# Altium project OBC_V1.PrjPcb
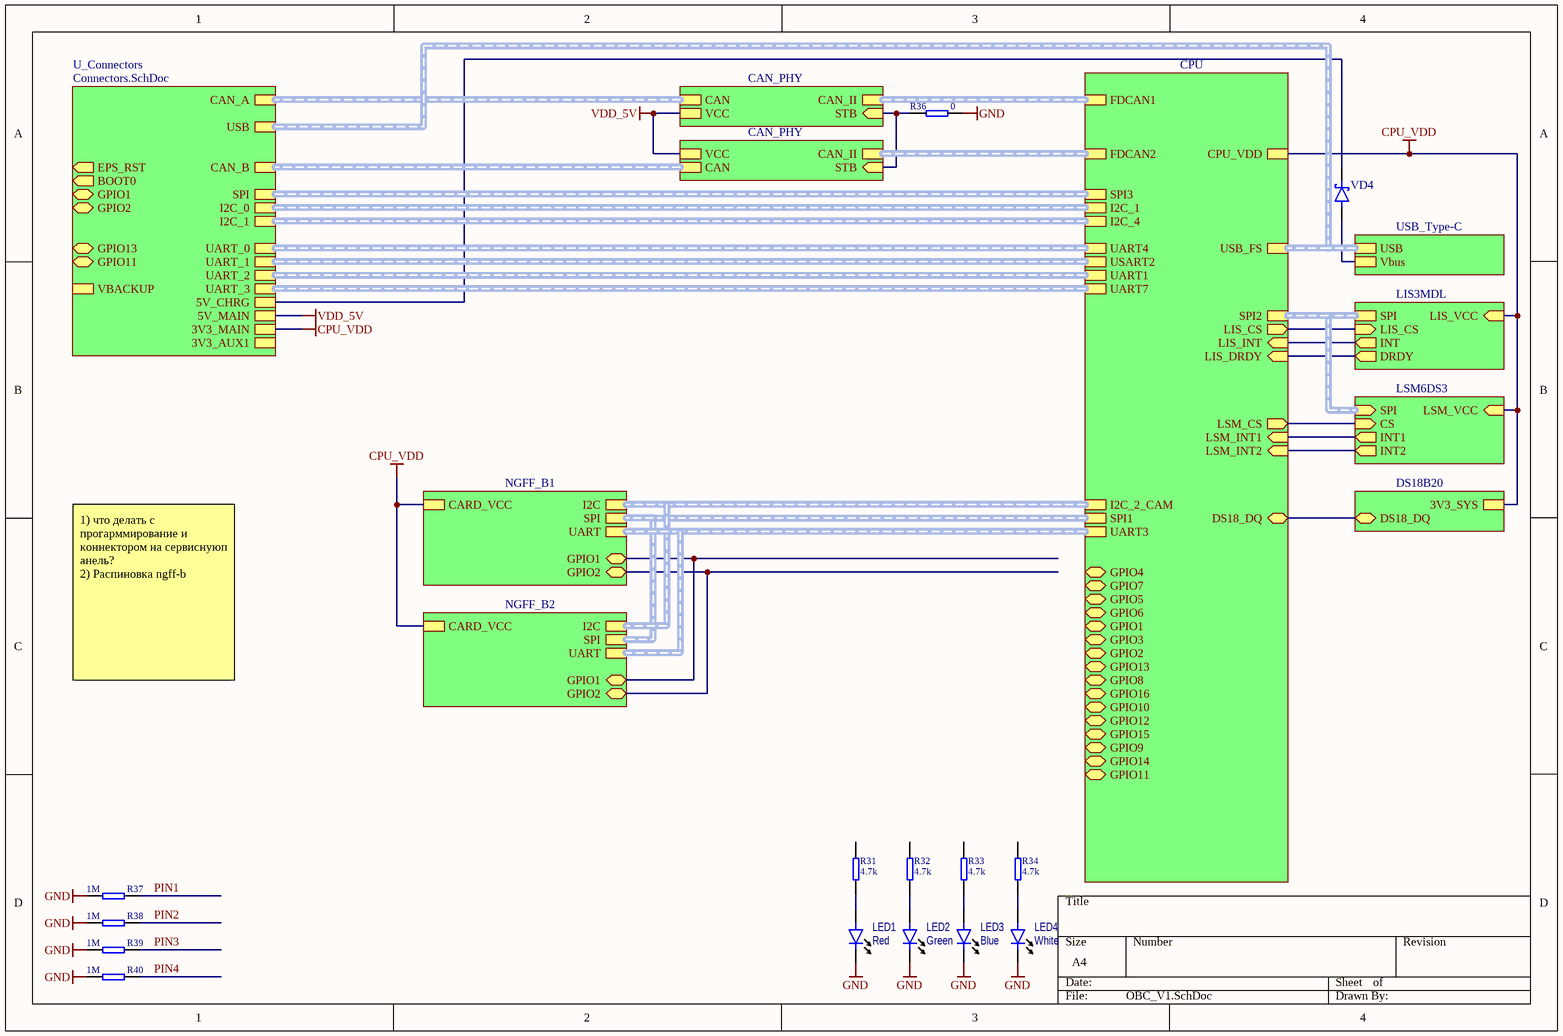
[diagram p0: OBC_V1.SchDoc]
11 sheets, 90 parts. Net scope: hierarchical (ports join the sheet entries above them; power ports are global).
Board files: OBC_V1.PcbDoc, NGFF_B_Board.PcbDoc
Sheets:
  OBC_V1.SchDoc
    U_Connectors = Connectors.SchDoc
    CPU = CPU.SchDoc
    LIS3MDL = LIS3MDL.SchDoc
    LSM6DS3 = LSM6DS3.SchDoc
    CAN_PHY = CAN_PHY.SchDoc
    CAN_PHY = CAN_PHY.SchDoc
    USB_Type-C = USB_Type-C.SchDoc
    DS18B20 = DS18B20.SchDoc
    NGFF_B1 = NGFF_B.SchDoc
    NGFF_B2 = NGFF_B.SchDoc
  Debugger.SchDoc
  Photodiode.SchDoc

## Sheet OBC_V1.SchDoc
size A4; SheetNumber: 1; SheetTotal: 11

### Parts
LED1  value Red  [LED 0805]
LED2  value Green  [LED 0805]
LED3  value Blue  [LED 0805]
LED4  value White  [LED 0805]
R31  value 4.7k  [RES 0603]
R32  value 4.7k  [RES 0603]
R33  value 4.7k  [RES 0603]
R34  value 4.7k  [RES 0603]
R36  value 0  [RES 0603]
R37  value 1M  [RES 0402]
R38  value 1M  [RES 0402]
R39  value 1M  [RES 0402]
R40  value 1M  [RES 0402]
VD4  (no value)  [SOD-123]

### Sub-sheets
CAN_PHY = CAN_PHY.SchDoc: VCC, STB (in), CAN (harness CAN), CAN_II (harness CAN_II)
CAN_PHY = CAN_PHY.SchDoc: VCC, STB (in), CAN (harness CAN), CAN_II (harness CAN_II)
CPU = CPU.SchDoc: SPI3 (harness SPI), I2C_2_CAM (harness I2C), I2C_1 (harness I2C), USB_FS (harness USB), SPI1 (harness SPI), I2C_4 (harness I2C), SPI2 (harness SPI), FDCAN1 (harness CAN_II), FDCAN2 (harness CAN_II), UART4 (harness UART), UART7 (harness UART), UART1 (harness UART), USART2 (harness UART), CPU_VDD, LIS_CS (out), LIS_INT (in), LIS_DRDY (in), LSM_CS (out), LSM_INT1 (in), LSM_INT2 (in), DS18_DQ (bidir), UART3 (harness UART), GPIO4 (bidir), GPIO7 (bidir), GPIO5 (bidir), GPIO6 (bidir), GPIO1 (bidir), GPIO3 (bidir), GPIO2 (bidir), GPIO13 (bidir), GPIO8 (bidir), GPIO16 (bidir), GPIO10 (bidir), GPIO12 (bidir), GPIO15 (bidir), GPIO9 (bidir), GPIO14 (bidir), GPIO11 (bidir)
DS18B20 = DS18B20.SchDoc: DS18_DQ (bidir), 3V3_SYS
LIS3MDL = LIS3MDL.SchDoc: LIS_VCC (in), SPI (harness SPI), DRDY (out), INT (out), LIS_CS (in)
LSM6DS3 = LSM6DS3.SchDoc: CS (in), LSM_VCC (in), SPI (in, harness SPI), INT1 (out), INT2 (out)
NGFF_B1 = NGFF_B.SchDoc: UART (harness UART), CARD_VCC, I2C (harness I2C), SPI (harness SPI), GPIO1 (bidir), GPIO2 (bidir)
NGFF_B2 = NGFF_B.SchDoc: UART (harness UART), CARD_VCC, I2C (harness I2C), SPI (harness SPI), GPIO1 (bidir), GPIO2 (bidir)
U_Connectors = Connectors.SchDoc: 3V3_MAIN, VBACKUP, CAN_A (harness CAN), CAN_B (harness CAN), I2C_0 (harness I2C), I2C_1 (harness I2C), 5V_CHRG, 3V3_AUX1, UART_1 (harness UART), UART_0 (harness UART), UART_2 (harness UART), UART_3 (harness UART), USB (harness USB), EPS_RST (out), BOOT0 (out), GPIO1 (bidir), GPIO2 (bidir), 5V_MAIN, SPI (harness SPI), GPIO13 (bidir), GPIO11 (bidir)
USB_Type-C = USB_Type-C.SchDoc: USB (harness USB), Vbus

### Nets
CPU_VDD: sheet U_Connectors/3V3_MAIN, sheet CPU/CPU_VDD, sheet LIS3MDL/LIS_VCC, sheet LSM6DS3/LSM_VCC, sheet DS18B20/3V3_SYS, sheet NGFF_B1/CARD_VCC, sheet NGFF_B2/CARD_VCC  [project net 3V3_MAIN]
GND: LED1.2(Cathode) LED2.2(Cathode) LED3.2(Cathode) LED4.2(Cathode) R36.2 R37.1 R38.1 R39.1 R40.1
VDD_5V: sheet U_Connectors/5V_MAIN, sheet CAN_PHY/VCC, sheet CAN_PHY/VCC  [project net 5V_MAIN]
5V_CHRG: VD4.C(Cathode) ; sheet U_Connectors/5V_CHRG
DS18_DQ: sheet CPU/DS18_DQ, sheet DS18B20/DS18_DQ
LIS_CS: sheet CPU/LIS_CS, sheet LIS3MDL/LIS_CS
LIS_DRDY: sheet CPU/LIS_DRDY, sheet LIS3MDL/DRDY
LIS_INT1: sheet CPU/LIS_INT, sheet LIS3MDL/INT
LSM_CS: sheet CPU/LSM_CS, sheet LSM6DS3/CS
LSM_INT1: sheet CPU/LSM_INT1, sheet LSM6DS3/INT1
LSM_INT2: sheet CPU/LSM_INT2, sheet LSM6DS3/INT2
PIN1: R37.2
PIN2: R38.2
PIN3: R39.2
PIN4: R40.2
NetLED1_1: LED1.1(Anode) R31.1
NetLED2_1: LED2.1(Anode) R32.1
NetLED3_1: LED3.1(Anode) R33.1
NetLED4_1: LED4.1(Anode) R34.1
NetR36_1: R36.1 ; sheet CAN_PHY/STB, sheet CAN_PHY/STB
NetUSB1_A4B9: VD4.A(Anode) ; sheet USB_Type-C/Vbus
NetX4_NGFF_B1_26: sheet NGFF_B1/GPIO2, sheet NGFF_B2/GPIO2
NetX4_NGFF_B1_28: sheet NGFF_B1/GPIO1, sheet NGFF_B2/GPIO1

Not connected (* = marked no-connect by the designer): R31 2(12); R32 2(12); R33 2(12); R34 2(12)

### Buses and harness runs
harness sheet CAN_PHY/CAN = sheet U_Connectors/CAN_A
harness sheet CAN_PHY/CAN = sheet U_Connectors/CAN_B
harness sheet CAN_PHY/CAN_II = sheet CPU/FDCAN1
harness sheet CAN_PHY/CAN_II = sheet CPU/FDCAN2
harness sheet CPU/I2C_1 = sheet U_Connectors/I2C_0
harness sheet CPU/I2C_2_CAM = sheet NGFF_B1/I2C = sheet NGFF_B2/I2C
harness sheet CPU/I2C_4 = sheet U_Connectors/I2C_1
harness sheet CPU/SPI1 = sheet NGFF_B1/SPI = sheet NGFF_B2/SPI
harness sheet CPU/SPI2 = sheet LIS3MDL/SPI = sheet LSM6DS3/SPI
harness sheet CPU/SPI3 = sheet U_Connectors/SPI
harness sheet CPU/UART1 = sheet U_Connectors/UART_2
harness sheet CPU/UART3 = sheet NGFF_B1/UART = sheet NGFF_B2/UART
harness sheet CPU/UART4 = sheet U_Connectors/UART_0
harness sheet CPU/UART7 = sheet U_Connectors/UART_3
harness sheet CPU/USART2 = sheet U_Connectors/UART_1
harness sheet CPU/USB_FS = sheet U_Connectors/USB = sheet USB_Type-C/USB

### Notes on the sheet
- 1) что делать с прогарммирование и коннектором на сервиснуюп анель?
  2) Распиновка ngff-b

### Library data of the parts
LED1-LED4 = LED: Light Emittering Diode; IsSMT: NoSMT
R31-R34 R36-R40 = !Resistor: Resistor; IsSMT: NoSMT
VD4 = DiodeS: Diode Shottky; IsSMT: NoSMT

## Sheet Connectors.SchDoc
size A4; SheetNumber: 2; SheetTotal: 11
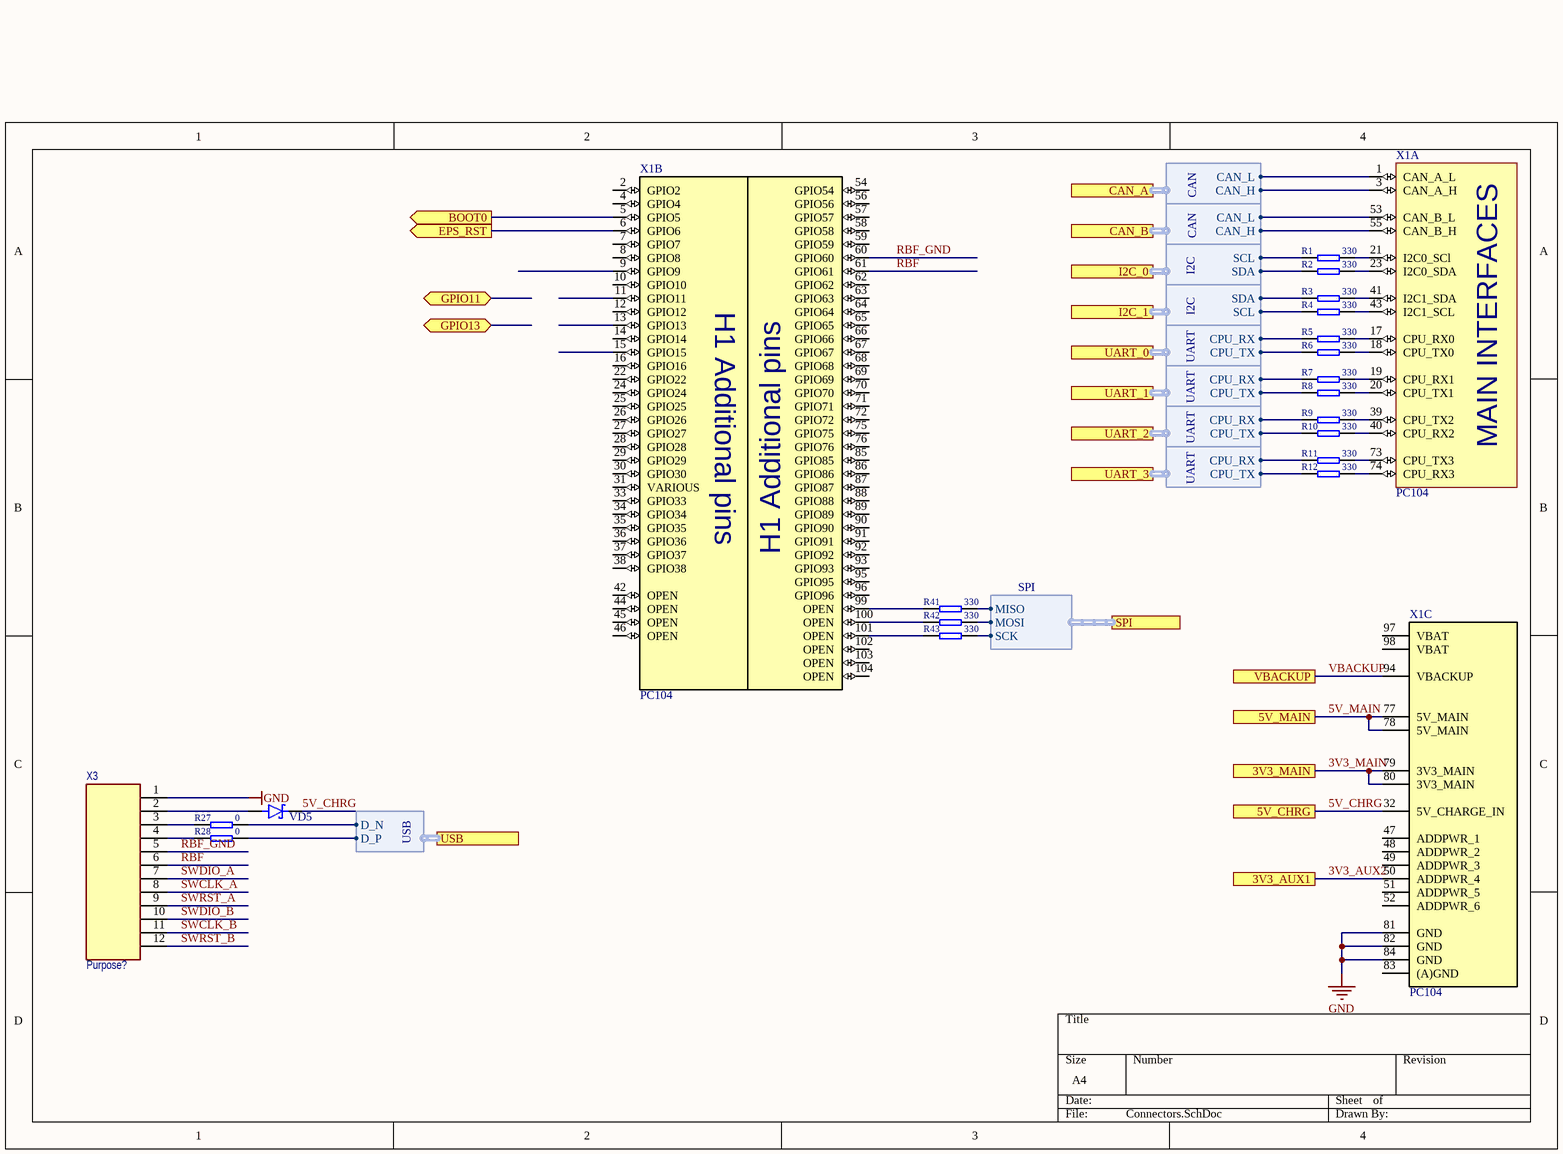
[diagram p1: Connectors.SchDoc]

### Parts
R1  value 330  [RES 0603]
R2  value 330  [RES 0603]
R3  value 330  [RES 0603]
R4  value 330  [RES 0603]
R5  value 330  [RES 0603]
R6  value 330  [RES 0603]
R7  value 330  [RES 0603]
R8  value 330  [RES 0603]
R9  value 330  [RES 0603]
R10  value 330  [RES 0603]
R11  value 330  [RES 0603]
R12  value 330  [RES 0603]
R27  value 0  [RES 0603]
R28  value 0  [RES 0603]
R41  value 330  [RES 0603]
R42  value 330  [RES 0603]
R43  value 330  [RES 0603]
VD5  (no value)  [SOD-123]
X1  PC104  [PC104_ArianSpace]  (parts A,B,C of 3)
X3  Purpose: Purpose?  [PicoBlade_12P]  (hidden comment: Header?)

### Ports
3V3_AUX1, 3V3_MAIN, 5V_CHRG, 5V_MAIN, BOOT0 (out), CAN_A (harness CAN), CAN_B (harness CAN), EPS_RST (out), GPIO11 (bidir), GPIO13 (bidir), I2C_0 (harness I2C), I2C_1 (harness I2C), SPI (harness SPI), UART_0 (harness UART), UART_1 (harness UART), UART_2 (harness UART), UART_3 (harness UART), USB (harness USB), VBACKUP

### Harnesses
CAN: CAN_H, CAN_L
I2C: SDA, SCL
UART: CPU_TX, CPU_RX
USB: D_N, D_P
SPI: SCK, MISO, MOSI

### Nets
3V3_MAIN: X1.79(3V3_MAIN) X1.80(3V3_MAIN) ; port 3V3_MAIN
5V_MAIN: X1.77(5V_MAIN) X1.78(5V_MAIN) ; port 5V_MAIN
GND: X1.81(GND) X1.82(GND) X1.84(GND) X3.1
3V3_AUX2: X1.50(ADDPWR_4) ; port 3V3_AUX1
5V_CHRG: VD5.C(Cathode) X1.32(5V_CHARGE_IN) ; port 5V_CHRG
CAN_H: X1.3(CAN_A_H) ; port CAN_A.CAN_H
CAN_H: X1.55(CAN_B_H) ; port CAN_B.CAN_H  [a separate net that carries the same name]
CAN_L: X1.1(CAN_A_L) ; port CAN_A.CAN_L
CAN_L: X1.53(CAN_B_L) ; port CAN_B.CAN_L  [a separate net that carries the same name]
CPU_RX1: R9.1 ; port UART_2.CPU_RX
CPU_RX2: R7.1 ; port UART_1.CPU_RX
CPU_RX4: R5.1 ; port UART_0.CPU_RX
CPU_RX7: R11.1 ; port UART_3.CPU_RX
CPU_TX1: R10.1 ; port UART_2.CPU_TX
CPU_TX2: R8.1 ; port UART_1.CPU_TX
CPU_TX4: R6.1 ; port UART_0.CPU_TX
CPU_TX7: R12.1 ; port UART_3.CPU_TX
I2C1_SCL: R1.1 ; port I2C_0.SCL
I2C1_SDA: R2.1 ; port I2C_0.SDA
I2C4_SCL: R4.1 ; port I2C_1.SCL
I2C4_SDA: R3.1 ; port I2C_1.SDA
RBF: X1.61(GPIO61) X3.6
RBF_GND: X1.60(GPIO60) X3.5
SPI3_MISO: R41.2 ; port SPI.MISO
SPI3_MOSI: R42.2 ; port SPI.MOSI
SPI3_SCK: R43.2 ; port SPI.SCK
SWCLK_A: X3.8
SWCLK_B: X3.11
SWDIO_A: X3.7
SWDIO_B: X3.10
SWRST_A: X3.9
SWRST_B: X3.12
USB_D_N: R27.2 ; port USB.D_N
USB_D_P: R28.2 ; port USB.D_P
VBACKUP: X1.94(VBACKUP) ; port VBACKUP
NetR1_2: R1.2 X1.21(I2C0_SCl)
NetR2_2: R2.2 X1.23(I2C0_SDA)
NetR3_2: R3.2 X1.41(I2C1_SDA)
NetR4_2: R4.2 X1.43(I2C1_SCL)
NetR5_2: R5.2 X1.17(CPU_RX0)
NetR6_2: R6.2 X1.18(CPU_TX0)
NetR7_2: R7.2 X1.19(CPU_RX1)
NetR8_2: R8.2 X1.20(CPU_TX1)
NetR9_2: R9.2 X1.39(CPU_TX2)
NetR10_2: R10.2 X1.40(CPU_RX2)
NetR11_2: R11.2 X1.73(CPU_TX3)
NetR12_2: R12.2 X1.74(CPU_RX3)
NetR27_1: R27.1 X3.3
NetR28_1: R28.1 X3.4
NetR41_1: R41.1 X1.99(OPEN)
NetR42_1: R42.1 X1.100(OPEN)
NetR43_1: R43.1 X1.101(OPEN)
NetVD5_A: VD5.A(Anode) X3.2
NetX1_5: X1.5(GPIO5) ; port BOOT0
NetX1_6: X1.6(GPIO6) ; port EPS_RST

Not connected (* = marked no-connect by the designer): X1 2(GPIO2) 4(GPIO4) 7(GPIO7) 8(GPIO8) 9(GPIO9) 10(GPIO10) 11(GPIO11) 12(GPIO12) 13(GPIO13) 14(GPIO14) 15(GPIO15) 16(GPIO16) 22(GPIO22) 24(GPIO24) 25(GPIO25) 26(GPIO26) 27(GPIO27) 28(GPIO28) 29(GPIO29) 30(GPIO30) 31(VARIOUS) 33(GPIO33) 34(GPIO34) 35(GPIO35) 36(GPIO36) 37(GPIO37) 38(GPIO38) 42(OPEN) 44(OPEN) 45(OPEN) 46(OPEN) 47(ADDPWR_1) 48(ADDPWR_2) 49(ADDPWR_3) 51(ADDPWR_5) 52(ADDPWR_6) 54(GPIO54) 56(GPIO56) 57(GPIO57) 58(GPIO58) 59(GPIO59) 62(GPIO62) 63(GPIO63) 64(GPIO64) 65(GPIO65) 66(GPIO66) 67(GPIO67) 68(GPIO68) 69(GPIO69) 70(GPIO70) 71(GPIO71) 72(GPIO72) 75(GPIO75) 76(GPIO76) 83((A)GND) 85(GPIO85) 86(GPIO86) 87(GPIO87) 88(GPIO88) 89(GPIO89) 90(GPIO90) 91(GPIO91) 92(GPIO92) 93(GPIO93) 95(GPIO95) 96(GPIO96) 97(VBAT) 98(VBAT) 102(OPEN) 103(OPEN) 104(OPEN)

### Notes on the sheet
- (in symbol PC104_ArianSpace, part A) MAIN INTERFACES
- (in symbol PC104_ArianSpace, part B) H1 Additional pins

### Library data of the parts
R1-R12 R27 R28 R41-R43 = !Resistor: Resistor; IsSMT: NoSMT
VD5 = DiodeS: Diode Shottky; IsSMT: NoSMT
X1 = PC104_ArianSpace: PC104 connector
X3 = Header 1x12: 10x1 Header; IsSMT: NoSMT

## Sheet CPU.SchDoc
size A4; SheetNumber: 3; SheetTotal: 11
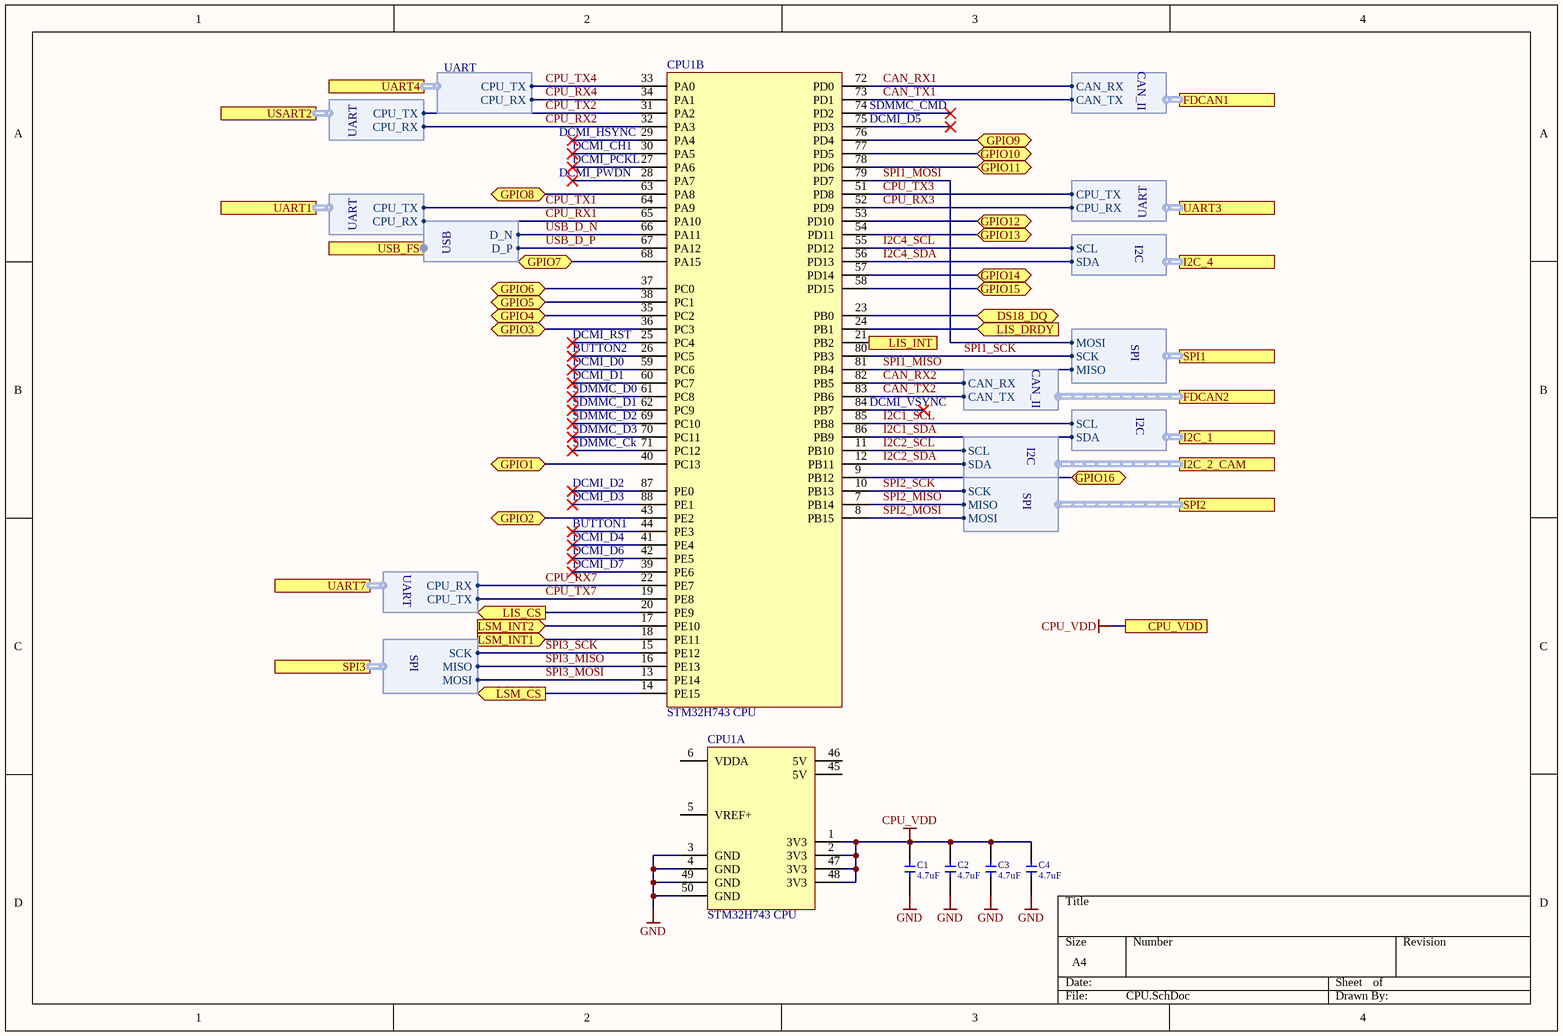
[diagram p2: CPU.SchDoc]

### Parts
C1  value 4.7uF  [CERCAP 0603]
C2  value 4.7uF  [CERCAP 0603]
C3  value 4.7uF  [CERCAP 0603]
C4  value 4.7uF  [CERCAP 0603]
CPU1  STM32H743 CPU  [STM32H7_CPU]  (parts A,B of 2)

### Ports
CPU_VDD, DS18_DQ (bidir), FDCAN1 (harness CAN_II), FDCAN2 (harness CAN_II), GPIO1 (bidir), GPIO2 (bidir), GPIO3 (bidir), GPIO4 (bidir), GPIO5 (bidir), GPIO6 (bidir), GPIO7 (bidir), GPIO8 (bidir), GPIO9 (bidir), GPIO10 (bidir), GPIO11 (bidir), GPIO12 (bidir), GPIO13 (bidir), GPIO14 (bidir), GPIO15 (bidir), GPIO16 (bidir), I2C_1 (harness I2C), I2C_2_CAM (harness I2C), I2C_4 (harness I2C), LIS_CS (out), LIS_DRDY (in), LIS_INT (in), LSM_CS (out), LSM_INT1 (in), LSM_INT2 (in), SPI1 (harness SPI), SPI2 (harness SPI), SPI3 (harness SPI), UART1 (harness UART), UART3 (harness UART), UART4 (harness UART), UART7 (harness UART), USART2 (harness UART), USB_FS (harness USB)

### Harnesses
I2C: SDA, SCL
CAN_II: CAN_RX, CAN_TX
SPI: MOSI, SCK, MISO
USB: D_N, D_P
UART: CPU_RX, CPU_TX

### Nets
CPU_VDD: C1.2 C2.2 C3.2 C4.2 CPU1.1(3V3) CPU1.2(3V3) CPU1.47(3V3) CPU1.48(3V3) ; port CPU_VDD  [project net 3V3_MAIN]
GND: C1.1 C2.1 C3.1 C4.1 CPU1.3(GND) CPU1.4(GND) CPU1.49(GND) CPU1.50(GND)
CAN_RX1: CPU1.72(PD0) ; port FDCAN1.CAN_RX
CAN_RX2: CPU1.82(PB5) ; port FDCAN2.CAN_RX
CAN_TX1: CPU1.73(PD1) ; port FDCAN1.CAN_TX
CAN_TX2: CPU1.83(PB6) ; port FDCAN2.CAN_TX
CPU_RX1: CPU1.65(PA10) ; port UART1.CPU_RX
CPU_RX2: CPU1.32(PA3) ; port USART2.CPU_RX
CPU_RX3: CPU1.52(PD9) ; port UART3.CPU_RX
CPU_RX4: CPU1.34(PA1) ; port UART4.CPU_RX
CPU_RX7: CPU1.22(PE7) ; port UART7.CPU_RX
CPU_TX1: CPU1.64(PA9) ; port UART1.CPU_TX
CPU_TX2: CPU1.31(PA2) ; port USART2.CPU_TX
CPU_TX3: CPU1.51(PD8) ; port UART3.CPU_TX
CPU_TX4: CPU1.33(PA0) ; port UART4.CPU_TX
CPU_TX7: CPU1.19(PE8) ; port UART7.CPU_TX
DS18_DQ: CPU1.23(PB0) ; port DS18_DQ
I2C1_SCL: CPU1.85(PB8) ; port I2C_1.SCL
I2C1_SDA: CPU1.86(PB9) ; port I2C_1.SDA
I2C2_SCL: CPU1.11(PB10) ; port I2C_2_CAM.SCL
I2C2_SDA: CPU1.12(PB11) ; port I2C_2_CAM.SDA
I2C4_SCL: CPU1.55(PD12) ; port I2C_4.SCL
I2C4_SDA: CPU1.56(PD13) ; port I2C_4.SDA
LIS_CS: CPU1.20(PE9) ; port LIS_CS
LIS_DRDY: CPU1.24(PB1) ; port LIS_DRDY
LIS_INT1: CPU1.21(PB2) ; port LIS_INT
LSM_CS: CPU1.14(PE15) ; port LSM_CS
LSM_INT1: CPU1.18(PE11) ; port LSM_INT1
LSM_INT2: CPU1.17(PE10) ; port LSM_INT2
SPI1_MISO: CPU1.81(PB4) ; port SPI1.MISO
SPI1_MOSI: CPU1.79(PD7) ; port SPI1.MOSI
SPI1_SCK: CPU1.80(PB3) ; port SPI1.SCK
SPI2_MISO: CPU1.7(PB14) ; port SPI2.MISO
SPI2_MOSI: CPU1.8(PB15) ; port SPI2.MOSI
SPI2_SCK: CPU1.10(PB13) ; port SPI2.SCK
SPI3_MISO: CPU1.16(PE13) ; port SPI3.MISO
SPI3_MOSI: CPU1.13(PE14) ; port SPI3.MOSI
SPI3_SCK: CPU1.15(PE12) ; port SPI3.SCK
USB_D_N: CPU1.66(PA11) ; port USB_FS.D_N
USB_D_P: CPU1.67(PA12) ; port USB_FS.D_P
NetCPU1_9: CPU1.9(PB12) ; port GPIO16
NetCPU1_35: CPU1.35(PC2) ; port GPIO4
NetCPU1_36: CPU1.36(PC3) ; port GPIO3
NetCPU1_37: CPU1.37(PC0) ; port GPIO6
NetCPU1_38: CPU1.38(PC1) ; port GPIO5
NetCPU1_40: CPU1.40(PC13) ; port GPIO1
NetCPU1_43: CPU1.43(PE2) ; port GPIO2
NetCPU1_53: CPU1.53(PD10) ; port GPIO12
NetCPU1_54: CPU1.54(PD11) ; port GPIO13
NetCPU1_57: CPU1.57(PD14) ; port GPIO14
NetCPU1_58: CPU1.58(PD15) ; port GPIO15
NetCPU1_63: CPU1.63(PA8) ; port GPIO8
NetCPU1_68: CPU1.68(PA15) ; port GPIO7
NetCPU1_76: CPU1.76(PD4) ; port GPIO9
NetCPU1_77: CPU1.77(PD5) ; port GPIO10
NetCPU1_78: CPU1.78(PD6) ; port GPIO11

Not connected (* = marked no-connect by the designer): CPU1 5(VREF+) 6(VDDA) 25(PC4)* 26(PC5)* 27(PA6)* 28(PA7)* 29(PA4)* 30(PA5)* 39(PE6)* 41(PE4)* 42(PE5)* 44(PE3)* 45(5V) 46(5V) 59(PC6)* 60(PC7)* 61(PC8)* 62(PC9)* 69(PC10)* 70(PC11)* 71(PC12)* 74(PD2)* 75(PD3)* 84(PB7)* 87(PE0)* 88(PE1)*

### Notes on the sheet
- (near CPU1) SDMMC_CMD
- (near CPU1) DCMI_HSYNC
- (near CPU1) DCMI_PWDN
- (near CPU1) DCMI_CH1
- (near CPU1) DCMI_PCKL
- (near CPU1) DCMI_D5
- (near CPU1) DCMI_D0
- (near CPU1) DCMI_D1
- (near CPU1) DCMI_RST
- (near CPU1) BUTTON2
- (near CPU1) SDMMC_D0
- (near CPU1) SDMMC_D1
- (near CPU1) SDMMC_D2
- (near CPU1) SDMMC_D3
- (near CPU1) SDMMC_Ck
- (near CPU1) DCMI_VSYNC
- (near CPU1) DCMI_D2
- (near CPU1) DCMI_D3
- (near CPU1) DCMI_D4
- (near CPU1) DCMI_D6
- (near CPU1) DCMI_D7
- (near CPU1) BUTTON1

### Library data of the parts
C1-C4 = !Capacitor: Capacitor; IsSMT: NoSMT; Diel: X7R; Voltage: *
CPU1 = STM32H7 CPU: STM32H743 processor module

## Sheet LIS3MDL.SchDoc
size A4; Organization: Altium Limited; Address1: L3, 12a Rodborough Rd; Address2: Frenchs Forest; Address3: NSW; Address4: Australia 2086; SheetNumber: 4; SheetTotal: 11
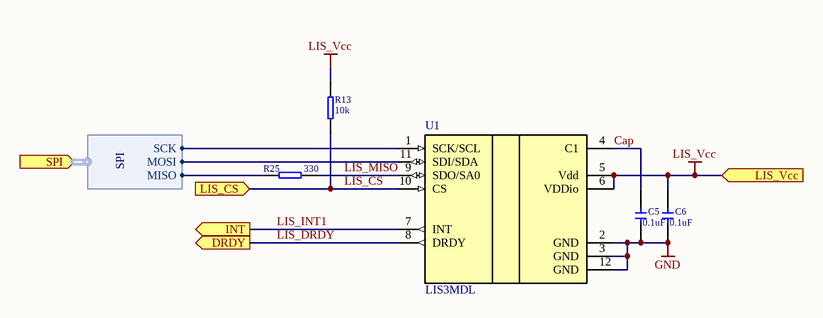
[diagram p3: LIS3MDL.SchDoc]

### Parts
C5  value 0.1uF  [CERCAP 0603]
C6  value 0.1uF  [CERCAP 0603]
R13  value 10k  [RES 0603]
R25  value 330  [RES 0603]
U1  LIS3MDL  [LGA12_LIS3MDL]

### Ports
DRDY (out), INT (out), LIS_CS (in), LIS_Vcc (in), SPI (in, harness SPI)

### Harnesses
SPI: SCK, MISO, MOSI

### Nets
GND: C5.1 C6.1 U1.2(GND) U1.3(GND) U1.12(GND)
LIS_Vcc: C6.2 R13.2 U1.5(Vdd) U1.6(VDDio) ; port LIS_Vcc  [project net 3V3_MAIN]
Cap: C5.2 U1.4(C1)
LIS_CS: R13.1 U1.10(CS) ; port LIS_CS
LIS_DRDY: U1.8(DRDY) ; port DRDY
LIS_INT1: U1.7(INT) ; port INT
LIS_MISO: R25.1 U1.9(SDO/SA0)
SPI2_MISO: R25.2 ; port SPI.MISO
SPI2_MOSI: U1.11(SDI/SDA) ; port SPI.MOSI
SPI2_SCK: U1.1(SCK/SCL) ; port SPI.SCK

### Notes on the sheet
- Title
- Size:
- Date:
- A4
- Number:
- Time:
- Revision:
- Sheet
- of
- File:

### Library data of the parts
C5 C6 = !Capacitor: Capacitor; IsSMT: NoSMT; Diel: X7R; Voltage: *
R13 R25 = !Resistor: Resistor; IsSMT: NoSMT
U1 = LIS3MDL: Mag; IsSMT: NoSMT

## Sheet LSM6DS3.SchDoc: =GlobalProjectName
size A4; ApprovedBy: Утвердил; CheckedBy: Проверил; Author: Разработал; SheetNumber: 5; SheetTotal: 11; PageSetup: Record=PageOptions|CenterHorizontal=True|CenterVertical=True|PrintScale=1.00|XCorrection=1.00|YCorrection=1.00|PrintKind=1|BorderSize=5000000|LeftOffset=0|BottomOffset=0|Orientation=2|PaperLength=1000|PaperWidth=1000|Scale=100|PaperSource=15|PrintQuality=1200|MediaType=1|DitherType=10|PaperKind=A3|PrintScaleMode=1; Weight: -; ScaleFactor: -; NormInspection: Норм.Контр.
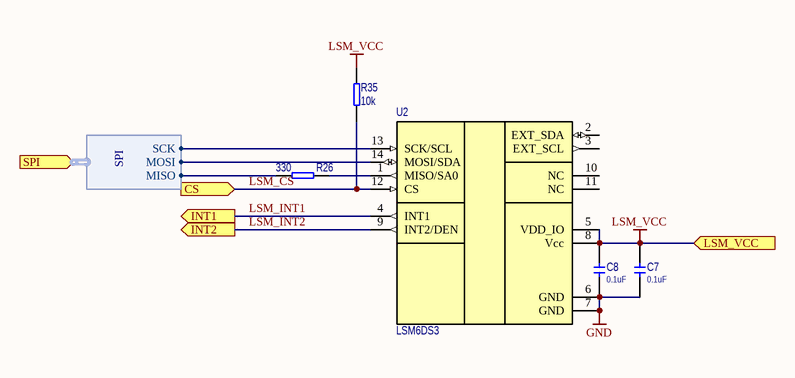
[diagram p4: LSM6DS3.SchDoc]

### Parts
C7  value 0.1uF  [CERCAP 0603]
C8  value 0.1uF  [CERCAP 0603]
R26  value 330  [RES 0603]
R35  value 10k  [RES 0603]
U2  LSM6DS3  [LGA14_LSM6DS3]

### Ports
CS (in), INT1 (out), INT2 (out), LSM_VCC (in), SPI (in, harness SPI)

### Harnesses
SPI: SCK, MOSI, MISO

### Nets
GND: C7.1 C8.1 U2.6(GND) U2.7(GND)
LSM_VCC: C7.2 C8.2 R35.2 U2.5(VDD_IO) U2.8(Vcc) ; port LSM_VCC  [project net 3V3_MAIN]
LSM_CS: R35.1 U2.12(CS) ; port CS
LSM_INT1: U2.4(INT1) ; port INT1
LSM_INT2: U2.9(INT2/DEN) ; port INT2
SPI2_MISO: R26.1 ; port SPI.MISO
SPI2_MOSI: U2.14(MOSI/SDA) ; port SPI.MOSI
SPI2_SCK: U2.13(SCK/SCL) ; port SPI.SCK
NetR26_2: R26.2 U2.1(MISO/SA0)

Not connected (* = marked no-connect by the designer): U2 2(EXT_SDA) 3(EXT_SCL) 10(NC) 11(NC)

### Notes on the sheet
- Title
- Size:
- Date:
- A4
- Number:
- Time:
- Revision:
- Sheet
- of
- File:

### Library data of the parts
C7 C8 = !Capacitor: Capacitor; IsSMT: NoSMT; Diel: X7R; Voltage: *
R26 R35 = !Resistor: Resistor; IsSMT: NoSMT
U2 = LSM6DS3: Acc/Gyro; IsSMT: NoSMT

## Sheet CAN_PHY.SchDoc
size A4; SheetNumber: 6; SheetTotal: 8
Used 2 times, as channels CAN_PHY, CAN_PHY. Parts and nets are listed once, with the designators drawn on the sheet.
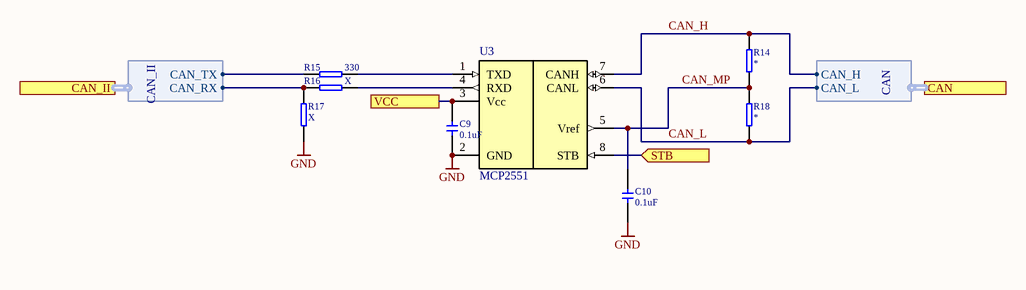
[diagram p5: CAN_PHY.SchDoc]

### Parts
C9  value 0.1uF  [CERCAP 0603]
C10  value 0.1uF  [CERCAP 0603]
R14  (no value)  [RES 0603]
R15  value 330  [RES 0603]
R16  value X  [RES 0603]
R17  value X  [RES 0603]
R18  (no value)  [RES 0603]
U3  MCP2551  [SO-8]

### Ports
CAN (harness CAN), CAN_II (harness CAN_II), STB (in), VCC

### Harnesses
CAN: CAN_H, CAN_L
CAN_II: CAN_RX, CAN_TX

### Nets
GND: C9.1 C10.1 R17.1 U3.2(GND)
CAN_H: R14.2 U3.7(CANH) ; port CAN.CAN_H
CAN_L: R18.1 U3.6(CANL) ; port CAN.CAN_L
CAN_MP: C10.2 R14.1 R18.2 U3.5(Vref)
STB: U3.8(STB) ; port STB
VCC: C9.2 U3.3(Vcc) ; port VCC
NetR15_1: R15.1 ; port CAN_II.CAN_TX
NetR15_2: R15.2 U3.1(TXD)
NetR16_1: R16.1 R17.2 ; port CAN_II.CAN_RX
NetR16_2: R16.2 U3.4(RXD)

### Channels
CAN_PHY: designators end in _CAN_PHY#1; ports STB=NetR36_1 VCC=5V_MAIN
CAN_PHY: designators end in _CAN_PHY#2; ports STB=NetR36_1 VCC=5V_MAIN

### Library data of the parts
C9 C10 = !Capacitor: Capacitor; IsSMT: NoSMT; Diel: X7R; Voltage: *
R14-R18 = !Resistor: Resistor; IsSMT: NoSMT
  R14 R18: Value: *
U3 = CAN_PHY: CAN PHY

## Sheet USB_Type-C.SchDoc
size A4; SheetNumber: 7; SheetTotal: 11
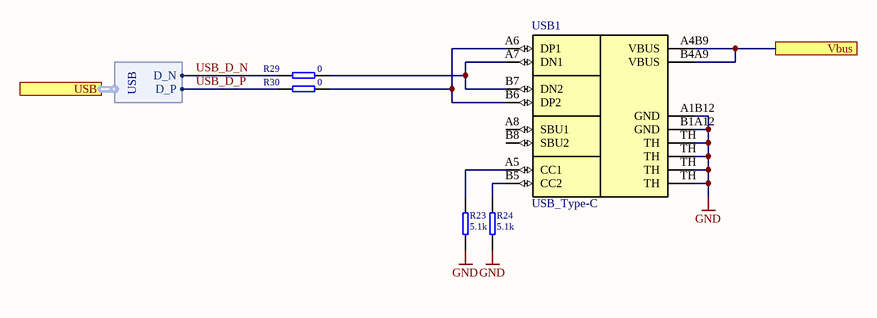
[diagram p6: USB_Type-C.SchDoc]

### Parts
R23  value 5.1k  [RES 0402]
R24  value 5.1k  [RES 0402]
R29  value 0  [RES 0402]
R30  value 0  [RES 0402]
USB1  USB_Type-C  [USB_Type-C]

### Ports
USB (harness USB), Vbus

### Harnesses
USB: D_N, D_P

### Nets
GND: R23.1 R24.1 USB1.A1B12(GND) USB1.B1A12(GND) USB1.TH
USB_D_N: R29.1 ; port USB.D_N
USB_D_P: R30.1 ; port USB.D_P
NetR23_2: R23.2 USB1.A5(CC1)
NetR24_2: R24.2 USB1.B5(CC2)
NetR29_2: R29.2 USB1.A7(DN1) USB1.B7(DN2)
NetR30_2: R30.2 USB1.A6(DP1) USB1.B6(DP2)
NetUSB1_A4B9: USB1.A4B9(VBUS) USB1.B4A9(VBUS) ; port Vbus

Not connected (* = marked no-connect by the designer): USB1 A8(SBU1) B8(SBU2)

### Library data of the parts
R23 R24 R29 R30 = !Resistor: Resistor; IsSMT: NoSMT
USB1 = USB_Type-C: USB Type-C connector

## Sheet DS18B20.SchDoc
size A4; SheetNumber: 8; SheetTotal: 11
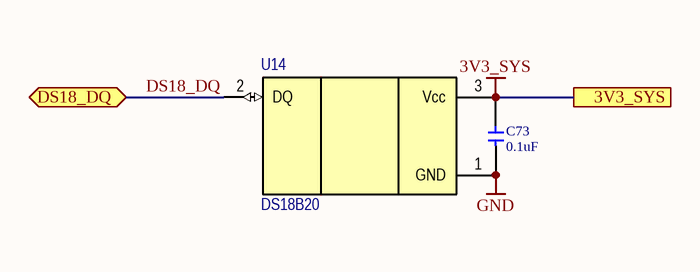
[diagram p7: DS18B20.SchDoc]

### Parts
C73  value 0.1uF  [CERCAP 0603]
U14  DS18B20  [TO-92]

### Ports
3V3_SYS, DS18_DQ (bidir)

### Nets
3V3_SYS: C73.2 U14.3(Vcc) ; port 3V3_SYS  [project net 3V3_MAIN]
GND: C73.1 U14.1(GND)
DS18_DQ: U14.2(DQ) ; port DS18_DQ

### Library data of the parts
C73 = !Capacitor: Capacitor; IsSMT: NoSMT; Diel: X7R; Voltage: *
U14 = DS18B20: Temp; IsSMT: NoSMT

## Sheet NGFF_B.SchDoc
size A4; SheetNumber: 9; SheetTotal: 11
Used 2 times, as channels NGFF_B1, NGFF_B2. Parts and nets are listed once, with the designators drawn on the sheet.
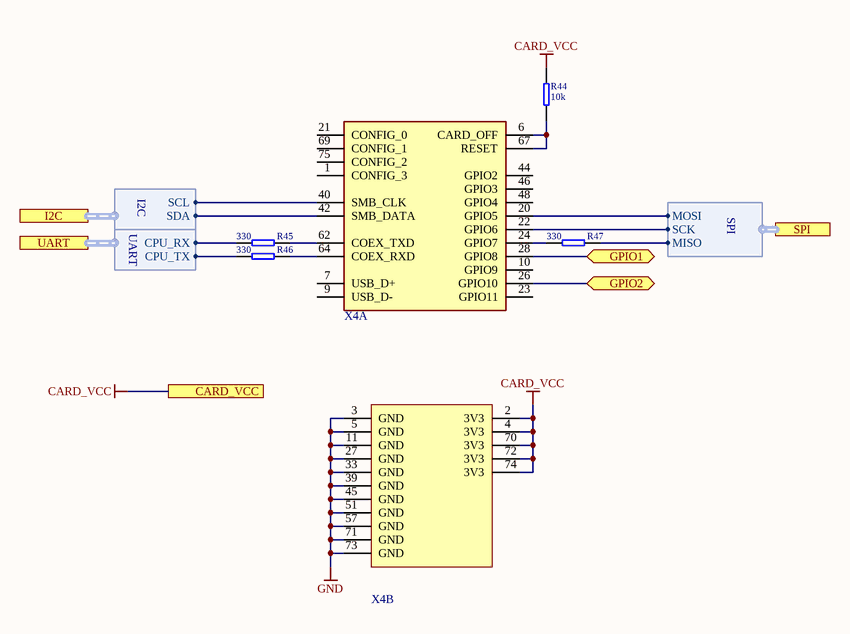
[diagram p8: NGFF_B.SchDoc]

### Parts
R44  value 10k  [RES 0402]
R45  value 330  [RES 0402]
R46  value 330  [RES 0402]
R47  value 330  [RES 0402]
X4  2199230-3  [NGFF_B3_30MM]  (value not drawn)  (parts A,B of 3)

### Ports
CARD_VCC, GPIO1 (bidir), GPIO2 (bidir), I2C (harness I2C), SPI (harness SPI), UART (harness UART)

### Harnesses
UART: CPU_RX, CPU_TX
I2C: SDA, SCL
SPI: MOSI, SCK, MISO

### Nets
CARD_VCC: R44.2 X4.2(3V3) X4.4(3V3) X4.70(3V3) X4.72(3V3) X4.74(3V3) ; port CARD_VCC
GND: X4.3(GND) X4.5(GND) X4.11(GND) X4.27(GND) X4.33(GND) X4.39(GND) X4.45(GND) X4.51(GND) X4.57(GND) X4.71(GND) X4.73(GND)
GPIO1: X4.28(GPIO8) ; port GPIO1
GPIO2: X4.26(GPIO10) ; port GPIO2
NetR44_1: R44.1 X4.6(CARD_OFF) X4.67(RESET)
NetR45_1: R45.1 ; port UART.CPU_RX
NetR45_2: R45.2 X4.62(COEX_TXD)
NetR46_1: R46.1 ; port UART.CPU_TX
NetR46_2: R46.2 X4.64(COEX_RXD)
NetR47_1: R47.1 X4.24(GPIO7)
NetR47_2: R47.2 ; port SPI.MISO
NetX4_20: X4.20(GPIO5) ; port SPI.MOSI
NetX4_22: X4.22(GPIO6) ; port SPI.SCK
NetX4_40: X4.40(SMB_CLK) ; port I2C.SCL
NetX4_42: X4.42(SMB_DATA) ; port I2C.SDA

Not connected (* = marked no-connect by the designer): X4 1(CONFIG_3) 7(USB_D+) 9(USB_D-) 10(GPIO9) 21(CONFIG_0) 23(GPIO11) 44(GPIO2) 46(GPIO3) 48(GPIO4) 69(CONFIG_1) 75(CONFIG_2)

### Channels
NGFF_B1: designators end in _NGFF_B1; ports CARD_VCC=3V3_MAIN GPIO1=NetX4_NGFF_B1_28 GPIO2=NetX4_NGFF_B1_26
NGFF_B2: designators end in _NGFF_B2; ports CARD_VCC=3V3_MAIN GPIO1=NetX4_NGFF_B1_28 GPIO2=NetX4_NGFF_B1_26

### Library data of the parts
R44-R47 = !Resistor: Resistor; IsSMT: NoSMT
X4 = NGFF_B: M.2 0.5PITCH 4.2H KEY B 15U'' AU

## Sheet Debugger.SchDoc
size A4; SheetNumber: 8; SheetTotal: 8
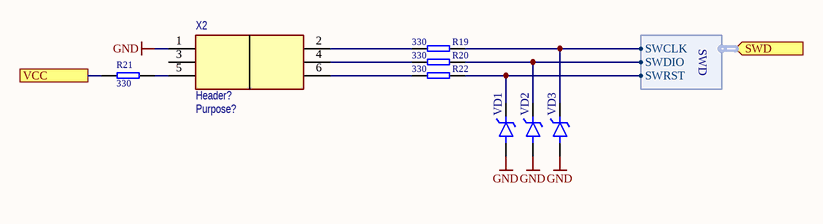
[diagram p9: Debugger.SchDoc]

### Parts
R19  value 330  [RES 0402]
R20  value 330  [RES 0402]
R21  value 330  [RES 0402]  (no BOM)
R22  value 330  [RES 0402]
VD1  DiodeTVSs  [SOD-323]  (value not drawn)
VD2  DiodeTVSs  [SOD-323]  (value not drawn)
VD3  DiodeTVSs  [SOD-323]  (value not drawn)
X2  Header?  Purpose: Purpose?  [PBD-6-2.54]

### Ports
SWD (in, harness SWD), VCC

### Harnesses
SWD: SWDIO, SWCLK, SWRST

### Nets
GND: VD1.A(Anode) VD2.A(Anode) VD3.A(Anode) X2.1
NetR19_1: R19.1 X2.2
NetR19_2: R19.2 VD3.C(Cathode) ; port SWD.SWCLK
NetR20_1: R20.1 X2.4
NetR20_2: R20.2 VD2.C(Cathode) ; port SWD.SWDIO
NetR21_1: R21.1 X2.5
NetR21_2: R21.2 ; port VCC
NetR22_1: R22.1 X2.6
NetR22_2: R22.2 VD1.C(Cathode) ; port SWD.SWRST

Not connected (* = marked no-connect by the designer): X2 3

### Library data of the parts
R19-R22 = !Resistor: Resistor; IsSMT: NoSMT
VD1-VD3 = DiodeTVSs: Diode TVS Single; IsSMT: NoSMT; Order: *; BuyLink1: *; LCSC Part #: *
X2 = Header 2x3: 3x2 header; IsSMT: NoSMT

## Sheet Photodiode.SchDoc
size A4; SheetNumber: 10; SheetTotal: 10

## Nets that join several sheets
3V3_MAIN: Connectors (X1.79 X1.80), CPU (8 pins), LIS3MDL (C6.2 R13.2 U1.5 U1.6), LSM6DS3 (5 pins), DS18B20 (C73.2 U14.3), NGFF_B1 (6 pins), NGFF_B2 (6 pins)
5V_MAIN: Connectors (X1.77 X1.78), CAN_PHY (C9_CAN_PHY#1.2 U3_CAN_PHY#1.3), CAN_PHY (C9_CAN_PHY#2.2 U3_CAN_PHY#2.3)
GND: OBC_V1 (9 pins), Connectors (X1.81 X1.82 X1.84 X3.1), CPU (8 pins), LIS3MDL (5 pins), LSM6DS3 (C7.1 C8.1 U2.6 U2.7), CAN_PHY (C9_CAN_PHY#1.1 C10_CAN_PHY#1.1 R17_CAN_PHY#1.1 U3_CAN_PHY#1.2), CAN_PHY (C9_CAN_PHY#2.1 C10_CAN_PHY#2.1 R17_CAN_PHY#2.1 U3_CAN_PHY#2.2), USB_Type-C (5 pins), DS18B20 (C73.1 U14.1), NGFF_B1 (11 pins), NGFF_B2 (11 pins), Debugger (VD1.A VD2.A VD3.A X2.1)
5V_CHRG: OBC_V1 (VD4.C), Connectors (VD5.C X1.32)
CAN_H: Connectors (X1.3), CAN_PHY (R14_CAN_PHY#1.2 U3_CAN_PHY#1.7)
CAN_H: Connectors (X1.55), CAN_PHY (R14_CAN_PHY#2.2 U3_CAN_PHY#2.7)
CAN_L: Connectors (X1.1), CAN_PHY (R18_CAN_PHY#1.1 U3_CAN_PHY#1.6)
CAN_L: Connectors (X1.53), CAN_PHY (R18_CAN_PHY#2.1 U3_CAN_PHY#2.6)
CAN_RX1: CPU (CPU1.72), CAN_PHY (R16_CAN_PHY#1.1 R17_CAN_PHY#1.2)
CAN_RX2: CPU (CPU1.82), CAN_PHY (R16_CAN_PHY#2.1 R17_CAN_PHY#2.2)
CAN_TX1: CPU (CPU1.73), CAN_PHY (R15_CAN_PHY#1.1)
CAN_TX2: CPU (CPU1.83), CAN_PHY (R15_CAN_PHY#2.1)
CPU_RX1: Connectors (R9.1), CPU (CPU1.65)
CPU_RX2: Connectors (R7.1), CPU (CPU1.32)
CPU_RX3: CPU (CPU1.52), NGFF_B1 (R45_NGFF_B1.1), NGFF_B2 (R45_NGFF_B2.1)
CPU_RX4: Connectors (R5.1), CPU (CPU1.34)
CPU_RX7: Connectors (R11.1), CPU (CPU1.22)
CPU_TX1: Connectors (R10.1), CPU (CPU1.64)
CPU_TX2: Connectors (R8.1), CPU (CPU1.31)
CPU_TX3: CPU (CPU1.51), NGFF_B1 (R46_NGFF_B1.1), NGFF_B2 (R46_NGFF_B2.1)
CPU_TX4: Connectors (R6.1), CPU (CPU1.33)
CPU_TX7: Connectors (R12.1), CPU (CPU1.19)
DS18_DQ: CPU (CPU1.23), DS18B20 (U14.2)
I2C1_SCL: Connectors (R1.1), CPU (CPU1.85)
I2C1_SDA: Connectors (R2.1), CPU (CPU1.86)
I2C2_SCL: CPU (CPU1.11), NGFF_B1 (X4_NGFF_B1.40), NGFF_B2 (X4_NGFF_B2.40)
I2C2_SDA: CPU (CPU1.12), NGFF_B1 (X4_NGFF_B1.42), NGFF_B2 (X4_NGFF_B2.42)
I2C4_SCL: Connectors (R4.1), CPU (CPU1.55)
I2C4_SDA: Connectors (R3.1), CPU (CPU1.56)
LIS_CS: CPU (CPU1.20), LIS3MDL (R13.1 U1.10)
LIS_DRDY: CPU (CPU1.24), LIS3MDL (U1.8)
LIS_INT1: CPU (CPU1.21), LIS3MDL (U1.7)
LSM_CS: CPU (CPU1.14), LSM6DS3 (R35.1 U2.12)
LSM_INT1: CPU (CPU1.18), LSM6DS3 (U2.4)
LSM_INT2: CPU (CPU1.17), LSM6DS3 (U2.9)
NetR36_1: OBC_V1 (R36.1), CAN_PHY (U3_CAN_PHY#1.8), CAN_PHY (U3_CAN_PHY#2.8)
NetUSB1_A4B9: OBC_V1 (VD4.A), USB_Type-C (USB1.A4B9 USB1.B4A9)
NetX4_NGFF_B1_26: NGFF_B1 (X4_NGFF_B1.26), NGFF_B2 (X4_NGFF_B2.26)
NetX4_NGFF_B1_28: NGFF_B1 (X4_NGFF_B1.28), NGFF_B2 (X4_NGFF_B2.28)
SPI1_MISO: CPU (CPU1.81), NGFF_B1 (R47_NGFF_B1.2), NGFF_B2 (R47_NGFF_B2.2)
SPI1_MOSI: CPU (CPU1.79), NGFF_B1 (X4_NGFF_B1.20), NGFF_B2 (X4_NGFF_B2.20)
SPI1_SCK: CPU (CPU1.80), NGFF_B1 (X4_NGFF_B1.22), NGFF_B2 (X4_NGFF_B2.22)
SPI2_MISO: CPU (CPU1.7), LIS3MDL (R25.2), LSM6DS3 (R26.1)
SPI2_MOSI: CPU (CPU1.8), LIS3MDL (U1.11), LSM6DS3 (U2.14)
SPI2_SCK: CPU (CPU1.10), LIS3MDL (U1.1), LSM6DS3 (U2.13)
SPI3_MISO: Connectors (R41.2), CPU (CPU1.16)
SPI3_MOSI: Connectors (R42.2), CPU (CPU1.13)
SPI3_SCK: Connectors (R43.2), CPU (CPU1.15)
USB_D_N: Connectors (R27.2), CPU (CPU1.66), USB_Type-C (R29.1)
USB_D_P: Connectors (R28.2), CPU (CPU1.67), USB_Type-C (R30.1)